# EAGLE design tritiled_nocell_rprogrammable (EAGLE 9.6.1)
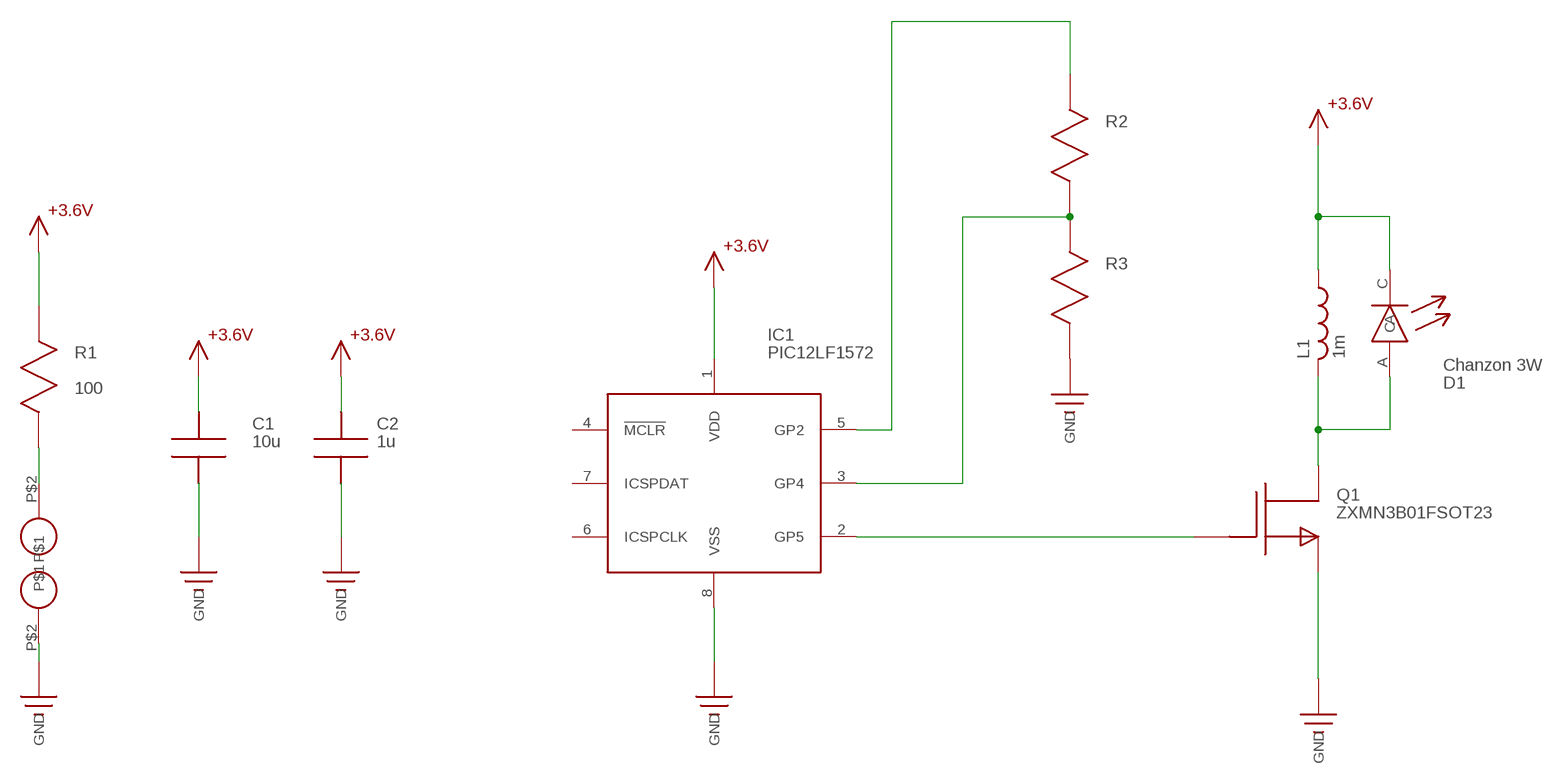
[diagram p0: schematic, sheet 1]

## Parts
C1  10u  C1206  [1206]
C2  1u  C0603  [C0603]
D1  Chanzon 3W  LED_3W  [LED_3W]
IC1  PIC12LF1572  PIC12LF1571  [SOIC8]
L1  1m  SRR6028_INDUCTOR  [SRR6028_INDUCTOR]
Q1  ZXMN3B01FSOT23  [SOT-23]
R1  100  R1206  [R1206]
R2  R1206  [R1206]
R3  R1206  [R1206]
U$7  ICSP_PAD  [ICSP_PAD]
U$9  ICSP_PAD  [ICSP_PAD]

## Nets
+3.6V: C1.P$1 C2.P$1 D1.C IC1.1(VDD) L1.P$1 R1.P$1
GND: C1.P$2 C2.P$2 IC1.8(VSS) Q1.2(S) R3.P$2 U$9.P$2
N$1: IC1.3(GP4) R2.P$2 R3.P$1
N$2: R1.P$2 U$7.P$2
N$3: IC1.5(GP2) R2.P$1
N$5: D1.A L1.P$2 Q1.3(D)
N$7: IC1.2(GP5) Q1.1(G)
Unconnected: IC1.4(!MCLR!) IC1.6(ICSPCLK) IC1.7(ICSPDAT)

## Library data of the parts
C1 C2 = tritiled:C
D1 = tritiled:LED_3W
IC1 = tritiled:PIC12LF1571
L1 = tritiled:SRR6028_INDUCTOR
Q1 = tritiled:ZXMN3B01F
R1-R3 = tritiled:R
U$7 U$9 = tritiled:ICSP_PAD

## Board
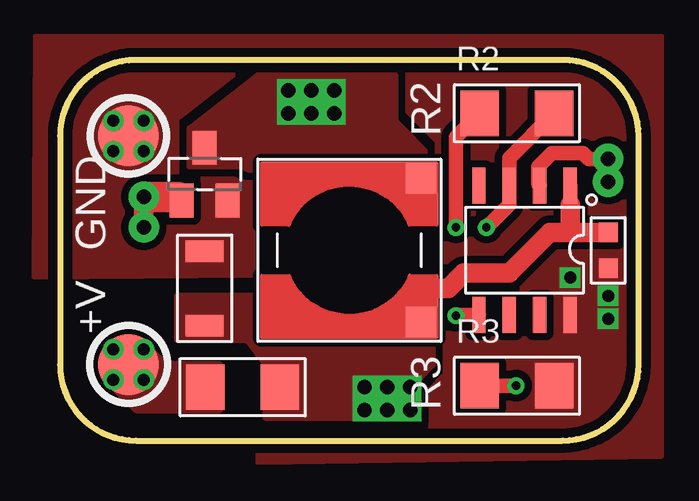
[diagram p1: board, top side]
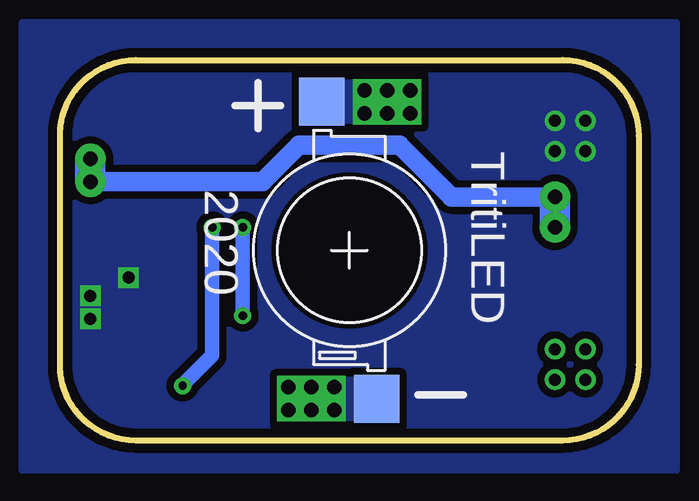
[diagram p2: board, bottom side, seen from below]

Size 24.13 x 15.88 mm. Coordinates in mm from the lower left corner, seen from the top.
Outline: 3.17,15.88 arc90 0,12.7 0,3.17 arc90 3.17,0 20.95,0 arc90 24.13,3.17 24.13,12.7 arc90 20.95,15.88 3.17,15.88
Copper layers (1*16): Top 0.0356mm / dielectric 1.5011mm / Bottom 0.0356mm
Design rules "LaenPCBOrder_tented_vias_12mil": minimum track width 8mil, minimum drill 13mil, track to track 12mil, track to pad 12mil, pad to pad 12mil, via to via 12mil, smd to smd 12mil, copper to edge 15mil, drill to drill 6mil, minimum pad ring 7mil, minimum via ring 7mil, stop-mask expansion 4mil, vias tented up to drill 28mil, thermal gap 10mil

### Footprints (pad centres in the part's own frame; a part is rotated, then mirrored left to right if it is on the bottom)
1206 = smd 0.9 x 1.6: P$1 -1.55,0; P$2 1.55,0
C0603 = smd 0.8 x 0.8: P$1 -0.75,0; P$2 0.75,0
LED_3W = smd 2 x 1.9: A 6.2,1.15; C -6.2,-1.15
SOIC8 = smd 0.55 x 1.5: 1 -1.905,-2.7; 2 -0.635,-2.7; 3 0.635,-2.7; 4 1.905,-2.7; 5 1.905,2.7; 6 0.635,2.7; 7 -0.635,2.7; 8 -1.905,2.7
SRR6028_INDUCTOR = smd 1.27 x 1.27: P$1 -3,3; P$2 -3,-3
SOT-23 = smd 1 x 1.4: 1 -0.95,-1.1; 2 0.95,-1.1; 3 0,1.1
R1206 = smd 1.6 x 1.9: P$1 -1.55,0; P$2 1.55,0
ICSP_PAD = smd 2.54 x 2.54: P$2 0,0

### Placement (x,y rotation side)
C1  6.03,6.35 90 top
C2  22.86,7.94 270 top
D1  12.06,7.94 90 bottom
IC1  19.37,7.94 180 top
L1  12.06,7.94 180 top
Q1  6.03,11.11 0 top
R1  7.62,2.22 180 top
R2  19.05,13.65 0 top
R3  19.05,2.29 0 top
U$7  2.86,3.17 0 top
U$9  2.86,12.7 0 top

### Tracks (layer width: path | path; a pad name or v marks a point on that pad's centre or on a via)
+3.6V  (via drill 0.6)
  Top 0.61: IC1.1 21.27,9.84
  Top 0.813: C2.P$1 21.27,8.69 | 21.27,8.69 20.43,8.69 18.73,6.99 16.83,6.99 16.19,6.35 15.24,6.35 15.24,5.11 L1.P$1 | 21.27,9.84 21.27,8.69
  other vias: 12.7,2.22 12.7,1.27 13.65,1.27 13.65,2.22 14.61,2.22 14.61,1.27
  pour Bottom (no thermals): 10.16,2.54 14.92,2.54 14.92,0.95 10.16,0.95
  pour Top (no thermals): 14.92,0.95 14.92,2.54 15.56,3.17 15.56,5.08 14.92,4.45 8.57,4.76 8.57,6.67 8.1,6.03 4.89,6.03 4.89,4.19 7.81,4.19 8.57,3.17 8.57,0.95
GND  (via drill 0.5)
  Top 0.305: v2.22,12.06 arc-90 U$9.P$2
  other vias: 2.22,13.34 3.49,13.34 3.49,12.06 21.27,6.79 22.86,6.03 22.86,5.08
  pour Bottom (rank 2, no thermals): -1.59,-1.27 25.72,-1.27 25.72,17.46 -1.59,17.46
  pour Top (rank 2, no thermals): -1.01,16.83 -1.08,6.85 8.05,6.92 8.26,-0.89 25.08,-0.64 25.08,16.83
N$1  (via drill 0.35)
  Top 0.61: R2.P$2 18.73,11.79 IC1.3 18.73,9.84 v17.78,8.89 | v19.02,2.29 R3.P$1
  Bottom 0.61: v17.78,8.89 17.78,3.56 19.02,2.32 v19.02,2.29
N$2  (via drill 0.5)
  Top 0.305: v2.22,3.81 arc90 U$7.P$2 | v3.49,3.81 arc-90 U$7.P$2 | v2.22,2.54 arc-90 U$7.P$2 | v3.49,2.54 arc90 U$7.P$2
  pour Top (no thermals): 6.67,3.17 5.08,3.17 4.45,3.17 3.81,3.81 2.22,3.81 2.22,2.22 3.17,1.27 6.67,1.27
N$3  (via drill 0.35)
  Top 0.61: R2.P$1 16.51,12.66 v16.51,8.89 | v16.51,5.21 16.54,5.24 IC1.5
  Bottom 0.61: v16.51,8.89 v16.51,5.21
N$5  (via drill 0.6)
  other vias: 11.43,14.61 11.43,13.65 10.48,13.65 9.53,13.65 9.53,14.61 10.48,14.61
  pour Bottom (no thermals): 9.21,14.92 13.97,14.92 13.97,13.34 9.21,13.34
  pour Top (no thermals): 8.26,15.24 13.97,15.24 13.97,13.34 15.56,11.75 15.56,11.11 8.26,11.11 7.62,11.43 5.4,11.43 5.4,13.02
N$7  (via drill 0.6 pad 1.27)
  Top 0.61: v22.86,11.75 22.05,11.75 21.8,12 20.51,12 19.94,11.43 19.94,10.7 IC1.2
  Top 0.813: v22.86,11.75 v22.86,10.79 | v3.49,8.89 v3.49,10.16 | Q1.1 4.93,10.16
  Top 1.27: 4.93,10.16 v3.49,10.16
  Bottom 0.813: v22.86,10.79 15.68,10.79 14.16,12.32 9.97,12.32 7.81,10.16 v3.49,10.16
  Bottom 1.27: 22.86,11.68 v22.86,10.79 | v3.49,10.16 v3.49,8.89

### Text on the board
tPlace: R2 | GND | +V | R3
bPlace: TritiLED | 2020